# EAGLE schematic G772X (EAGLE 6.6.0)
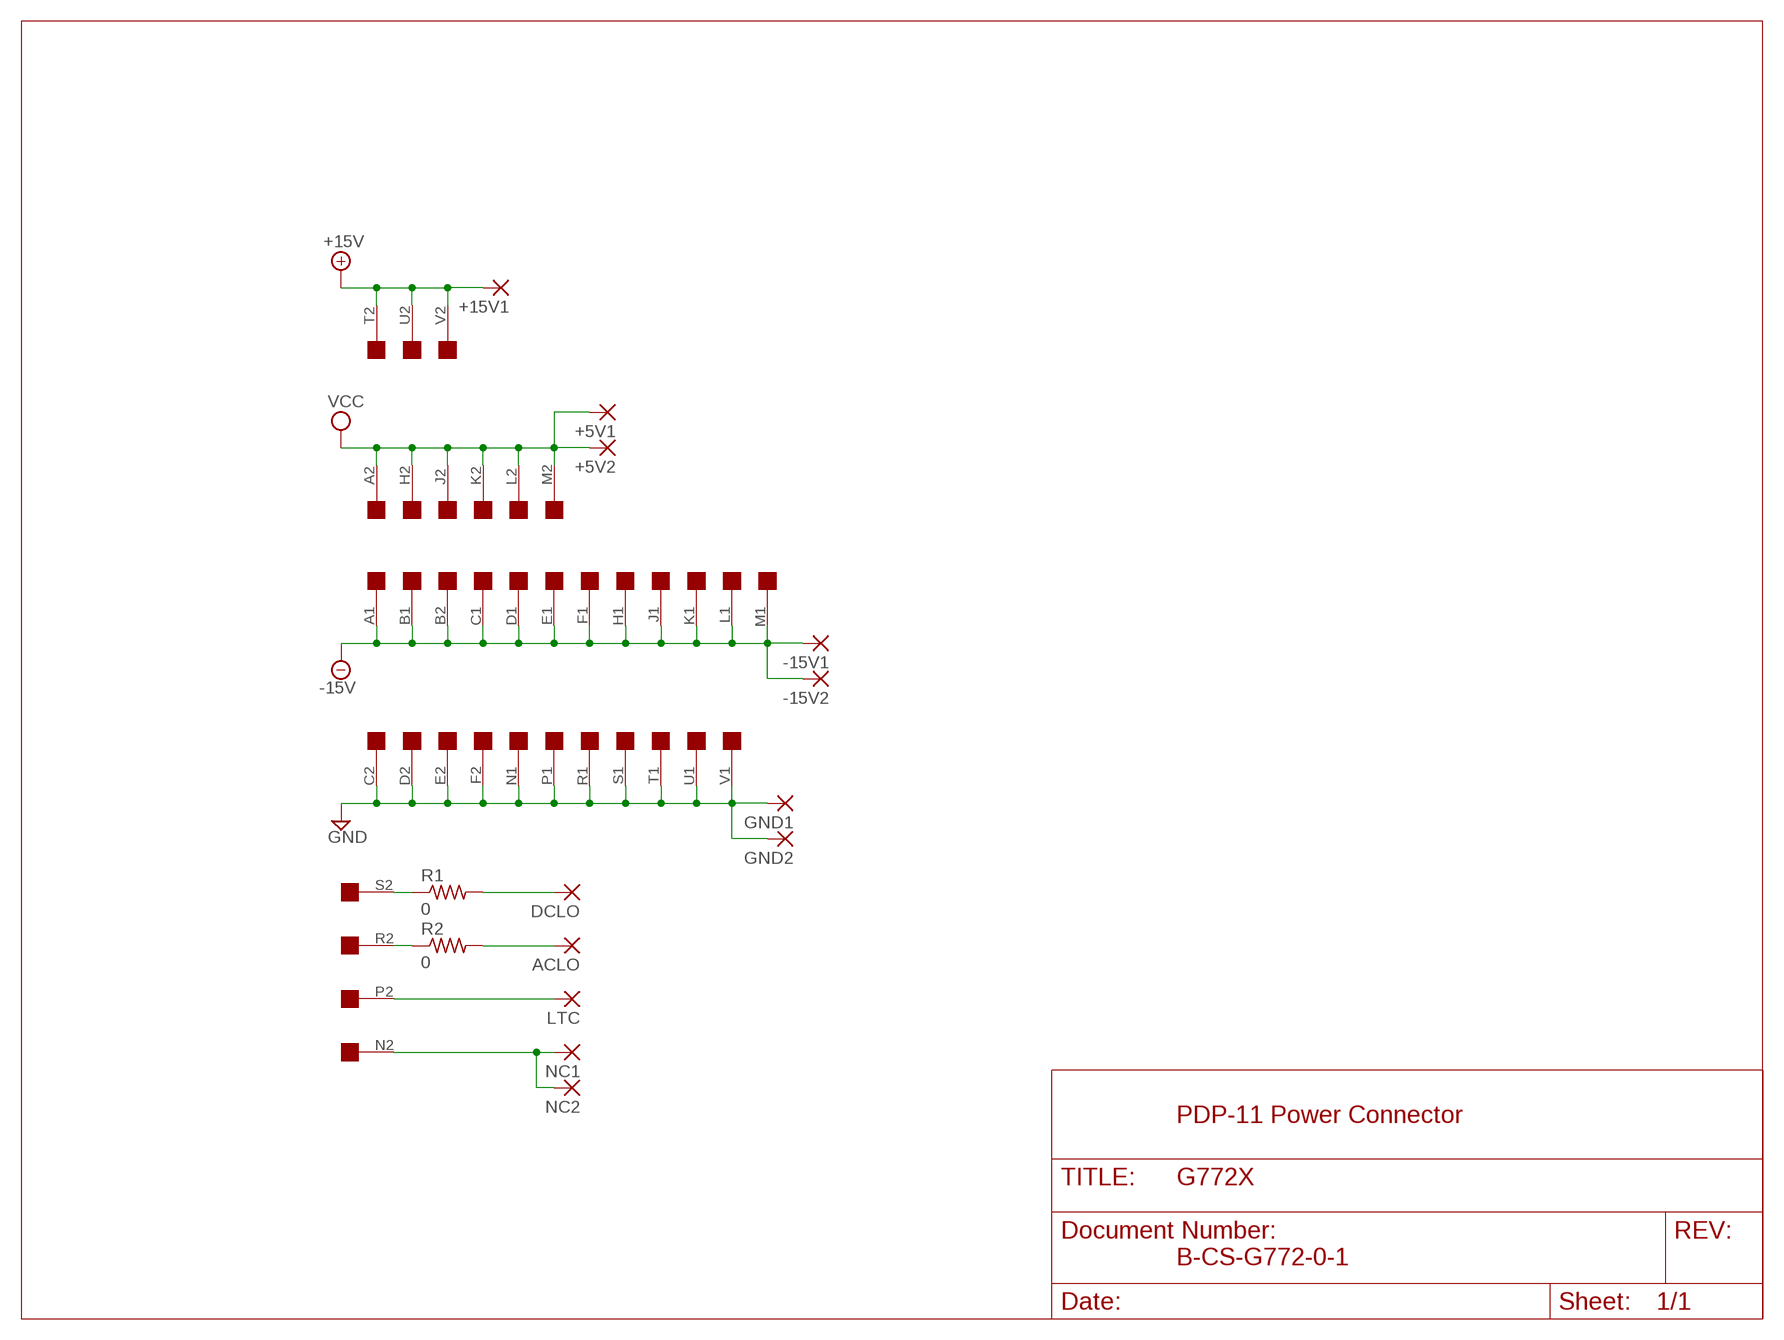
[diagram p0: schematic, sheet 1]

## Parts
+5V1  2,54/1,0  [2,54/1,0]
+5V2  2,54/1,0  [2,54/1,0]
+15V1  2,54/1,0  [2,54/1,0]
-15V1  2,54/1,0  [2,54/1,0]
-15V2  2,54/1,0  [2,54/1,0]
ACLO  2,54/1,0  [2,54/1,0]
DCLO  2,54/1,0  [2,54/1,0]
GND1  2,54/1,0  [2,54/1,0]
GND2  2,54/1,0  [2,54/1,0]
LTC  2,54/1,0  [2,54/1,0]
NC1  2,54/1,0  [2,54/1,0]
NC2  2,54/1,0  [2,54/1,0]
R1  0  R-US_0207/10  [0207/10]
R2  0  R-US_0207/10  [0207/10]
U$1  SINGLE  [EDGE-CON2]

## Nets
+15V: +15V1.1(P) U$1.T2 U$1.U2 U$1.V2
-15V: -15V1.1(P) -15V2.1(P) U$1.A1 U$1.B1 U$1.B2 U$1.C1 U$1.D1 U$1.E1 U$1.F1 U$1.H1 U$1.J1 U$1.K1 U$1.L1 U$1.M1
ACLO: ACLO.1(P) R2.2
DCLO: DCLO.1(P) R1.2
GND: GND1.1(P) GND2.1(P) U$1.C2 U$1.D2 U$1.E2 U$1.F2 U$1.N1 U$1.P1 U$1.R1 U$1.S1 U$1.T1 U$1.U1 U$1.V1
LTC: LTC.1(P) U$1.P2
N$1: R2.1 U$1.R2
N$2: R1.1 U$1.S2
NC: NC1.1(P) NC2.1(P) U$1.N2
VCC: +5V1.1(P) +5V2.1(P) U$1.A2 U$1.H2 U$1.J2 U$1.K2 U$1.L2 U$1.M2

## Notes on the sheet
- PDP-11 Power Connector
- B-CS-G772-0-1

## Library data of the parts
+5V1 +5V2 +15V1 -15V1 -15V2 ACLO DCLO GND1 GND2 LTC NC1 NC2 = wirepad:2,54/1,0: THROUGH-HOLE PAD
R1 R2 = rcl:R-US_: RESISTOR, American symbol
U$1 = dec-con:SINGLE: Single-Height DEC board

## Net classes
0 default: width 0.813 mm